# EAGLE design atmega8 (EAGLE 6.6.0)
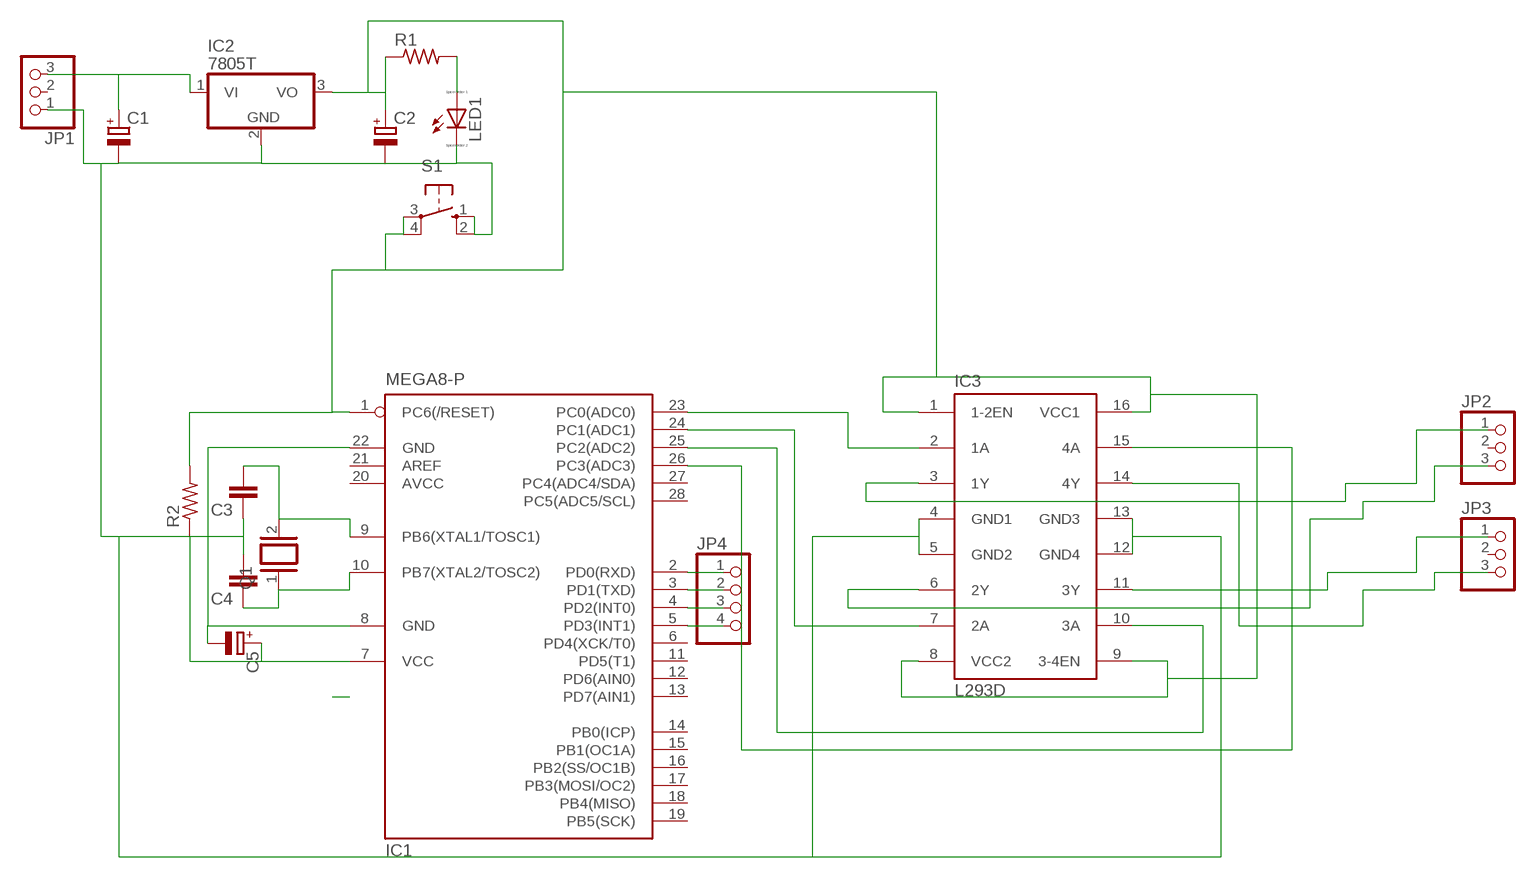
[diagram p0: schematic, sheet 1]

## Parts
C1  CPOL-EUE5-6  [E5-6]
C2  CPOL-EUE5-6  [E5-6]
C3  C-EU025-025X050  [C025-025X050]
C4  C-EU025-025X050  [C025-025X050]
C5  CPOL-EUE5-6  [E5-6]
IC1  MEGA8-P  [DIL28-3]
IC2  7805T  [TO220H]
IC3  L293D  [DIL16]
JP1  PINHD-1X3  [1X03]
JP2  PINHD-1X3  [1X03]
JP3  PINHD-1X3  [1X03]
JP4  PINHD-1X4  [1X04]
LED1  LED_ELD260  [LED_LD260]
Q1  XTAL/S  [QS]
R1  R-US_0204/7  [0204/7]
R2  R-US_0204/7  [0204/7]
S1  10-XX  [B3F-10XX]

## Nets
N$1: C1.+ IC2.1(VI) JP1.3
N$2: C1.- C2.- C3.1 C4.2 C5.- IC1.8(GND) IC1.22(GND) IC2.2(GND) IC3.4(GND1) IC3.5(GND2) IC3.12(GND4) IC3.13(GND3) JP1.1 LED1.K(C) S1.1(S) S1.2(S1)
N$3: C5.+ IC1.7(VCC) R2.1
N$5: LED1.A R1.2
N$6: C4.1 IC1.10(PB7(XTAL2/TOSC2)) Q1.1
N$7: IC1.23(PC0(ADC0)) IC3.2(1A)
N$8: IC1.24(PC1(ADC1)) IC3.7(2A)
N$9: C3.2 IC1.9(PB6(XTAL1/TOSC1)) Q1.2
N$11: C2.+ IC1.1(PC6(/RESET)) IC2.3(VO) IC3.1(1-2EN) IC3.8(VCC2) IC3.9(3-4EN) IC3.16(VCC1) R1.1 R2.2 S1.3(P) S1.4(P1)
N$12: IC1.25(PC2(ADC2)) IC3.10(3A)
N$13: IC1.26(PC3(ADC3)) IC3.15(4A)
N$14: IC3.3(1Y) JP2.1
N$15: IC3.6(2Y) JP2.3
N$16: IC3.11(3Y) JP3.1
N$17: IC3.14(4Y) JP3.3
N$18: IC1.2(PD0(RXD)) JP4.1
N$19: IC1.3(PD1(TXD)) JP4.2
N$20: IC1.4(PD2(INT0)) JP4.3
N$21: IC1.5(PD3(INT1)) JP4.4
Unconnected: IC1.6(PD4(XCK/T0)) IC1.11(PD5(T1)) IC1.12(PD6(AIN0)) IC1.13(PD7(AIN1)) IC1.14(PB0(ICP)) IC1.15(PB1(OC1A)) IC1.16(PB2(SS/OC1B)) IC1.17(PB3(MOSI/OC2)) IC1.18(PB4(MISO)) IC1.19(PB5(SCK)) IC1.21(AREF) IC1.27(PC4(ADC4/SDA)) IC1.28(PC5(ADC5/SCL)) JP1.2 JP2.2 JP3.2

## Power pins joined to a net without a drawn wire
AVCC: IC1.20(AVCC)

## Library data of the parts
C1 C2 C5 = resistor:CPOL-EU: POLARIZED CAPACITOR, European symbol
C3 C4 = rcl:C-EU: CAPACITOR, European symbol
IC1 = atmel:MEGA8-P: MICROCONTROLLER 8 Kbytes FLASH, 1 kbytes SRAM, 512 bytes EEPROM, USART, 4-channel 10 bit ADC, 2-channel 8 bit ADC Pin compatible with Atmega48, ATMega88, ATMega168 Source: avr.lbr; OC_FARNELL: unknown; OC_NEWARK: unknown
IC2 = linear:78*: Positive VOLTAGE REGULATOR Source: http://cache.national.com/ds/LM/LM78L05.pdf http://www.fairchildsemi.com/ds/LM/LM7805.pdf
IC3 = st-microelectronics:L293D: PUSH-PULL 4 CHANNEL DRIVER; MPN: L293D; OC_FARNELL: 9589619; OC_NEWARK: 56P8249
JP1-JP3 = pinhead:PINHD-1X3: PIN HEADER
JP4 = pinhead:PINHD-1X4: PIN HEADER
LED1 = eagle-ltspice:LED_E: LED Source: http://www.osram.convergy.de Source: www.luxeon.com Source: www.kingbright.com; SPICEMODEL: NONE; SPICEPREFIX: D; SPICETYPE: diode
Q1 = special:XTAL/S: CRYSTAL
R1 R2 = rcl:R-US_: RESISTOR, American symbol
S1 = switch-omron:10-XX: OMRON SWITCH; MPN: B3F-1000; OC_FARNELL: 176432; OC_NEWARK: 36M3542

## Board
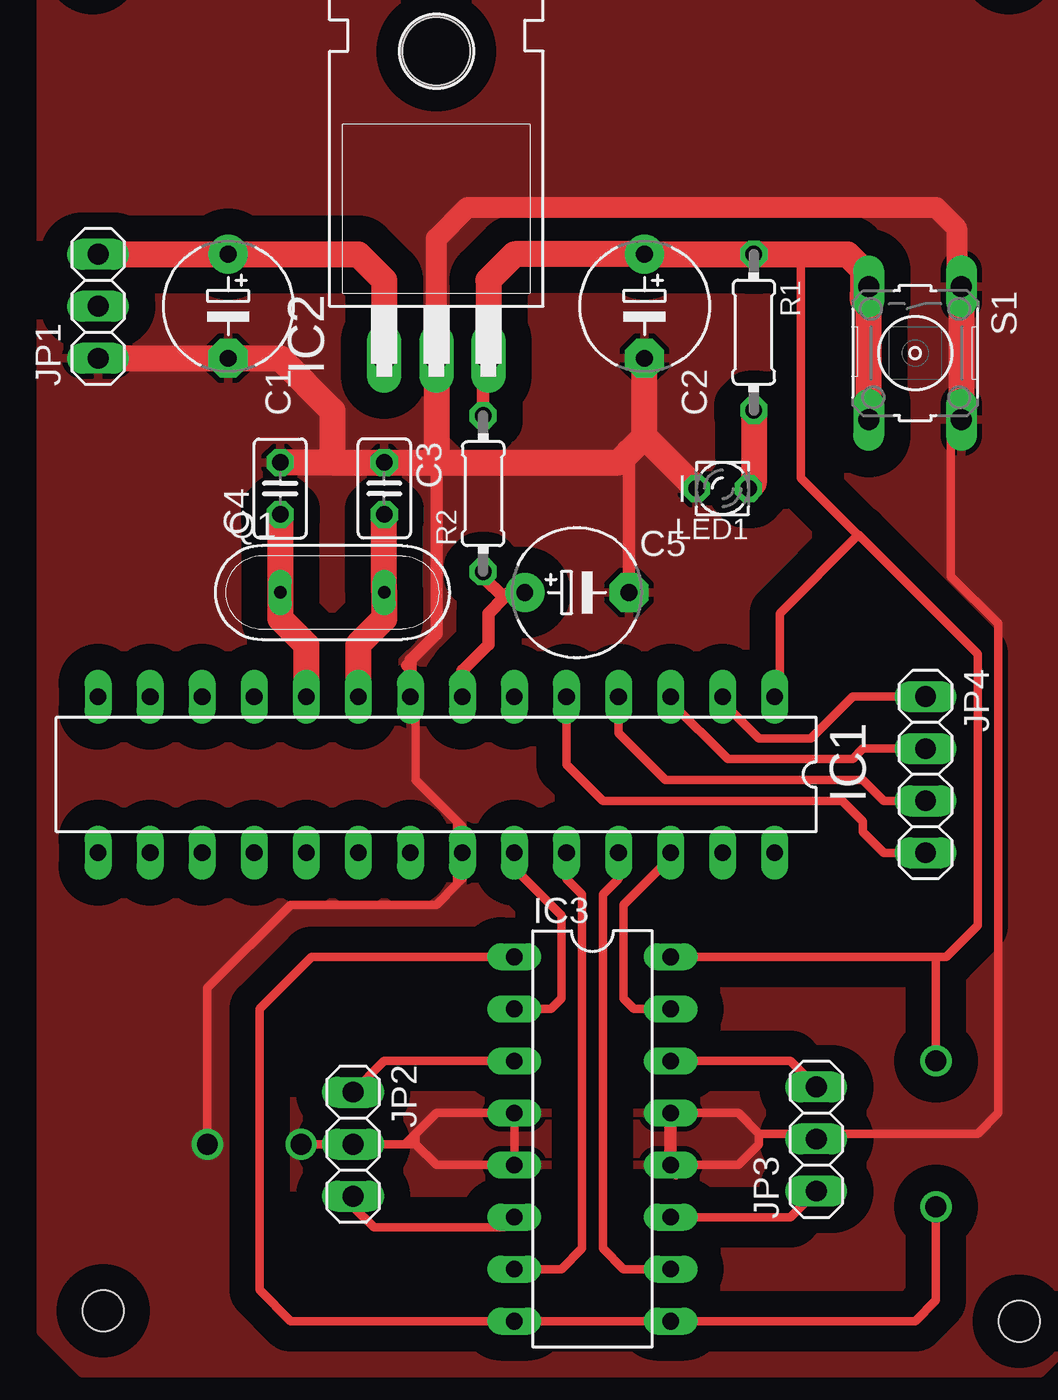
[diagram p1: board, top side]
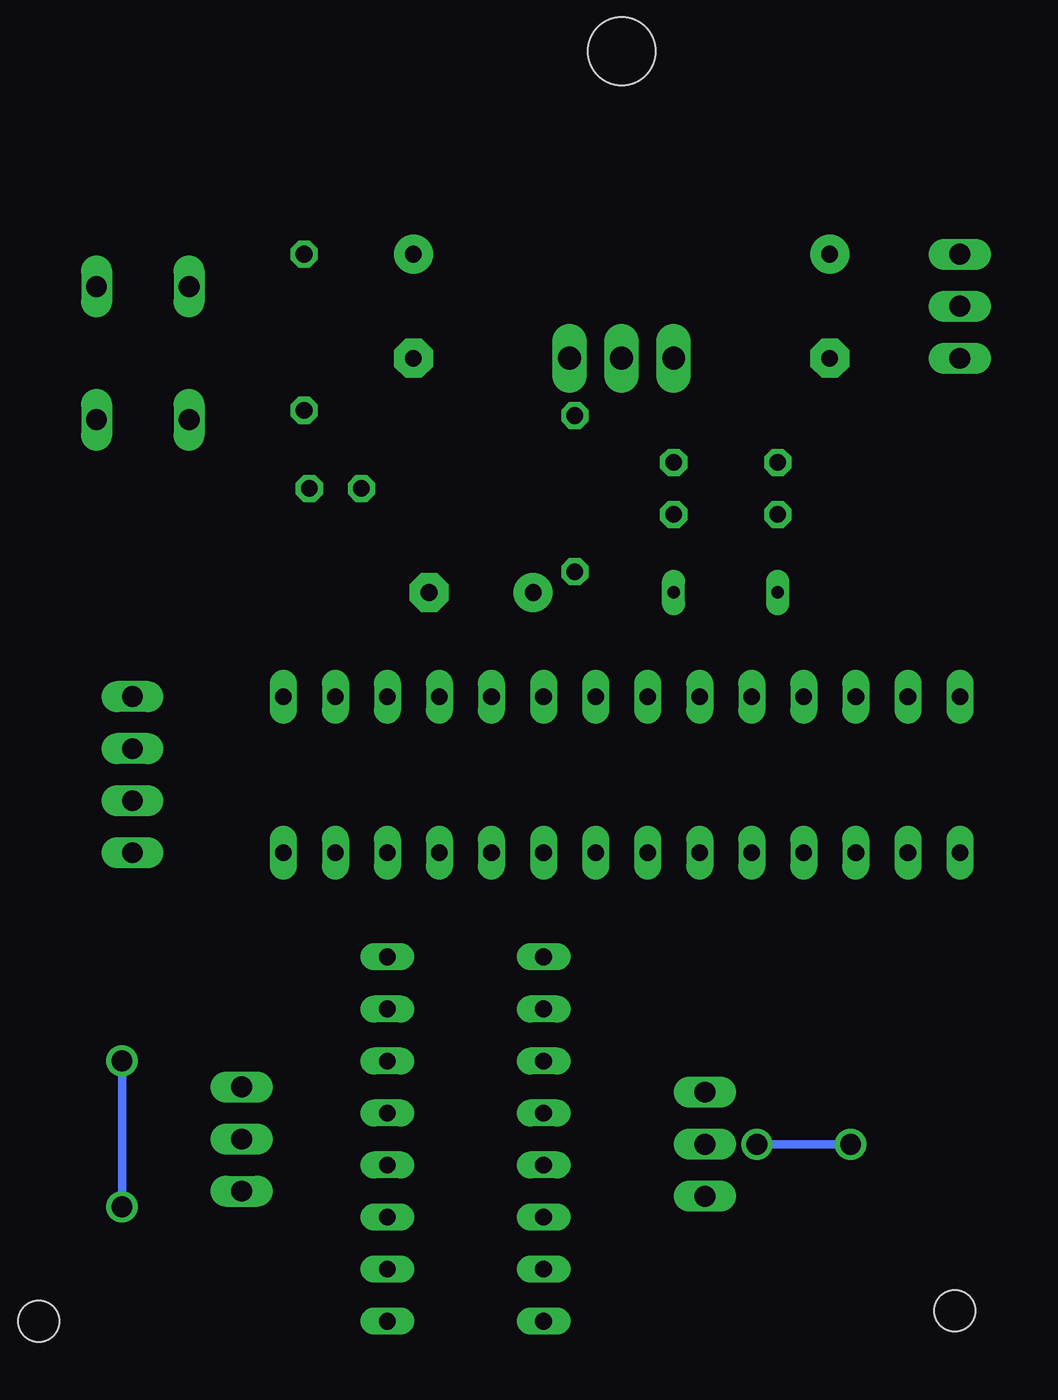
[diagram p2: board, bottom side, seen from below]

No outline drawn. Coordinates in mm, seen from the top.
Copper layers (1*16): Top 0.035mm / dielectric 1.5mm / Bottom 0.035mm
Design rules "default": minimum track width 10mil, minimum drill 24mil, track to track 8mil, track to pad 8mil, pad to pad 8mil, via to via 8mil, smd to smd 8mil, copper to edge 40mil, drill to drill 8mil, minimum pad ring 10mil, minimum via ring 8mil, stop-mask expansion 4mil, vias tented up to drill 0mil, thermal gap 10mil
Holes 2 mm at 18.8,96.52 63.5,96.52 64.01,30.48 19.3,30.99

### Footprints (pad centres in the part's own frame; a part is rotated, then mirrored left to right if it is on the bottom)
E5-6 = drill 0.813 pad 1.905: + -2.54,0 | drill 0.813 pad 1.905 octagon: - 2.54,0
C025-025X050 = drill 0.813 octagon: 1 -1.27,0; 2 1.27,0
DIL28-3 = drill 0.813 long: 1 -16.51,-3.81; 2 -13.97,-3.81; 3 -11.43,-3.81; 4 -8.89,-3.81; 5 -6.35,-3.81; 6 -3.81,-3.81; 7 -1.27,-3.81; 8 1.27,-3.81; 9 3.81,-3.81; 10 6.35,-3.81; 11 8.89,-3.81; 12 11.43,-3.81; 13 13.97,-3.81; 14 16.51,-3.81; 15 16.51,3.81; 16 13.97,3.81; 17 11.43,3.81; 18 8.89,3.81; 19 6.35,3.81; 20 3.81,3.81; 21 1.27,3.81; 22 -1.27,3.81; 23 -3.81,3.81; 24 -6.35,3.81; 25 -8.89,3.81; 26 -11.43,3.81; 27 -13.97,3.81; 28 -16.51,3.81
TO220H = drill 1.118 long: 1 -2.54,-10.16; 2 0,-10.16; 3 2.54,-10.16 | hole 3.302: 0,4.826
DIL16 = drill 0.813 long: 1 -8.89,-3.81; 2 -6.35,-3.81; 3 -3.81,-3.81; 4 -1.27,-3.81; 5 1.27,-3.81; 6 3.81,-3.81; 7 6.35,-3.81; 8 8.89,-3.81; 9 8.89,3.81; 10 6.35,3.81; 11 3.81,3.81; 12 1.27,3.81; 13 -1.27,3.81; 14 -3.81,3.81; 15 -6.35,3.81; 16 -8.89,3.81
1X03 = drill 1.016 long: 1 -2.54,0; 2 0,0; 3 2.54,0
1X04 = drill 1.016 long: 1 -3.81,0; 2 -1.27,0; 3 1.27,0; 4 3.81,0
LED_LD260 = drill 0.813 octagon: A -1.27,0; K 1.27,0
QS = drill 0.61 long: 1 -2.54,0; 2 2.54,0
0204/7 = drill 0.813 octagon: 1 -3.81,0; 2 3.81,0
B3F-10XX = drill 1.016 long: 1 -3.251,2.261; 2 3.251,2.261; 3 -3.251,-2.261; 4 3.251,-2.261

### Placement (x,y rotation side)
C1  25.4,80.01 270 top
C2  45.72,80.01 270 top
C3  33.02,71.12 270 top
C4  27.94,71.12 90 top
C5  42.42,66.04 0 top
IC1  35.56,57.15 180 top
IC2  35.56,87.63 0 top
IC3  43.18,39.37 270 top
JP1  19.05,80.01 90 top
JP2  31.5,39.12 270 top
JP3  54.1,39.37 90 top
JP4  59.44,57.15 270 top
LED1  49.53,71.12 180 top
Q1  30.48,66.04 0 top
R1  51.05,78.74 270 top
R2  37.85,70.87 90 top
S1  58.93,77.72 270 top

### Tracks (layer width: path | path; a pad name or v marks a point on that pad's centre or on a via)
N$1
  Top 1.27: JP1.3 C1.+ 31.75,82.55 33.02,81.28 IC2.1
N$2  (via drill 1.02)
  Top 0.406: 36.58,54.86 36.83,54.61 IC1.22 36.83,52.07 36.58,51.82 | 34.54,60.71 34.54,56.9 36.58,54.86 | 34.54,60.71 IC1.8 | IC3.13 50.29,40.64 51.31,39.62 | 47.75,38.1 50.29,38.1 51.31,39.12 51.31,39.62 | 47.75,38.1 47.24,37.59 47.24,38.1 47.75,38.1 | IC3.4 IC3.5 35.56,38.1 34.54,39.12 | 34.54,39.62 35.56,40.64 39.62,40.64 | 34.54,39.62 34.54,39.12 | 34.54,39.12 34.04,39.12 | 51.31,39.62 61.98,39.62 62.99,40.64 62.99,64.52 60.68,66.83 60.68,73.97 S1.2 | 34.54,39.62 34.04,39.12 | 34.04,39.12 v28.96,39.12 | v24.38,39.12 24.38,46.74 28.45,50.8 35.56,50.8 36.58,51.82 | 36.58,51.82 36.58,54.86 | 34.54,60.71 34.54,61.98 34.04,62.48 35.56,64.01 35.56,77.22
  Top 0.61: IC1.8 34.29,62.74 35.56,64.01 35.56,71.88 36.07,72.39 | C5.- 44.96,72.9 | IC3.12 IC3.13
  Top 1.016: 35.56,77.22 35.56,83.31 37.08,84.84 59.94,84.84 60.96,83.82 60.96,81.2 S1.1
  Top 1.27: JP1.1 C1.- 27.94,77.47 30.48,74.93 30.48,72.39 | 35.56,72.39 C3.1 30.48,72.39 | 35.56,72.39 36.07,72.39 44.45,72.39 44.96,72.9 45.72,73.66 | 45.72,73.66 C2.- | LED1.K 45.72,73.66 | 30.48,72.39 C4.2 | IC2.2 35.56,77.22 35.56,72.39 | S1.1 S1.2
  Bottom 0.406: v28.96,39.12 v24.38,39.12
  pour Top (isolate 1.27): 16.26,96.52 16.26,29.97 18.29,27.94 65.02,27.94 66.55,29.46 66.55,97.54 65.02,99.06 17.78,99.06 16.26,97.54
N$3
  Top 0.61: IC1.7 36.83,62.23 38.1,63.5 38.1,65.02 38.86,65.79 | 38.86,65.79 39.12,66.04 C5.+ | R2.1 37.85,66.8 38.86,65.79
N$5
  Top 1.27: R1.2 51.05,71.37 LED1.A
N$6
  Top 1.27: C4.1 Q1.1 27.94,64.77 29.21,63.5 IC1.10
N$7
  Top 0.406: IC1.23 39.37,52.58 41.66,50.29 41.66,46.23 41.15,45.72 IC3.2
N$8
  Top 0.406: IC1.24 41.91,52.07 42.67,51.31 42.67,34.04 41.66,33.02 IC3.7
N$9
  Top 1.27: C3.2 Q1.2 33.02,64.77 31.75,63.5 IC1.9
N$11  (via drill 1.02)
  Top 0.406: 56.16,68.86 52.32,65.02 52.32,61.21 IC1.1 | IC3.16 59.94,48.26 | 59.94,48.26 60.45,48.26 61.98,49.78 61.98,63.04 56.16,68.86 | 56.16,68.86 56.11,68.86 53.34,71.63 53.34,82.55 | IC3.1 29.46,48.26 26.92,45.72 26.92,32 28.45,30.48 IC3.8 IC3.9 58.93,30.48 59.94,31.5 v59.94,36.07 | v59.94,43.18 59.94,48.26
  Top 0.61: R2.2 37.85,77.22 IC2.3
  Top 1.27: IC2.3 38.1,81.28 39.37,82.55 C2.+ R1.1 53.34,82.55 55.63,82.55 56.39,81.79 56.39,80.7 | 56.39,80.26 56.39,80.7 | 56.39,80.7 S1.3 S1.4
  Bottom 0.406: v59.94,36.07 v59.94,43.18
N$12
  Top 0.406: IC1.25 44.45,52.07 43.69,51.31 43.69,34.04 44.7,33.02 IC3.10
N$13
  Top 0.406: IC1.26 46.99,53.09 44.7,50.8 44.7,46.23 45.21,45.72 IC3.15
N$14
  Top 0.406: JP2.1 33.02,43.18 IC3.3
N$15
  Top 0.406: JP2.3 31.5,36.07 32.51,35.05 38.86,35.05 IC3.6
N$16
  Top 0.406: IC3.11 52.83,35.56 JP3.1
N$17
  Top 0.406: IC3.14 52.83,43.18 JP3.3
N$18
  Top 0.406: IC1.2 49.53,60.71 51.31,58.93 53.85,58.93 55.88,60.96 JP4.1
N$19
  Top 0.406: IC1.3 46.99,60.71 49.78,57.91 55.88,57.91 56.39,58.42 JP4.2
N$20
  Top 0.406: IC1.4 44.45,59.18 46.74,56.9 56.39,56.9 57.4,55.88 JP4.3
N$21
  Top 0.406: IC1.5 41.91,57.66 43.69,55.88 55.37,55.88 56.39,54.86 56.39,54.36 57.4,53.34 JP4.4